# Altium schematic sheet RMT_SCH.SchDoc
size A4
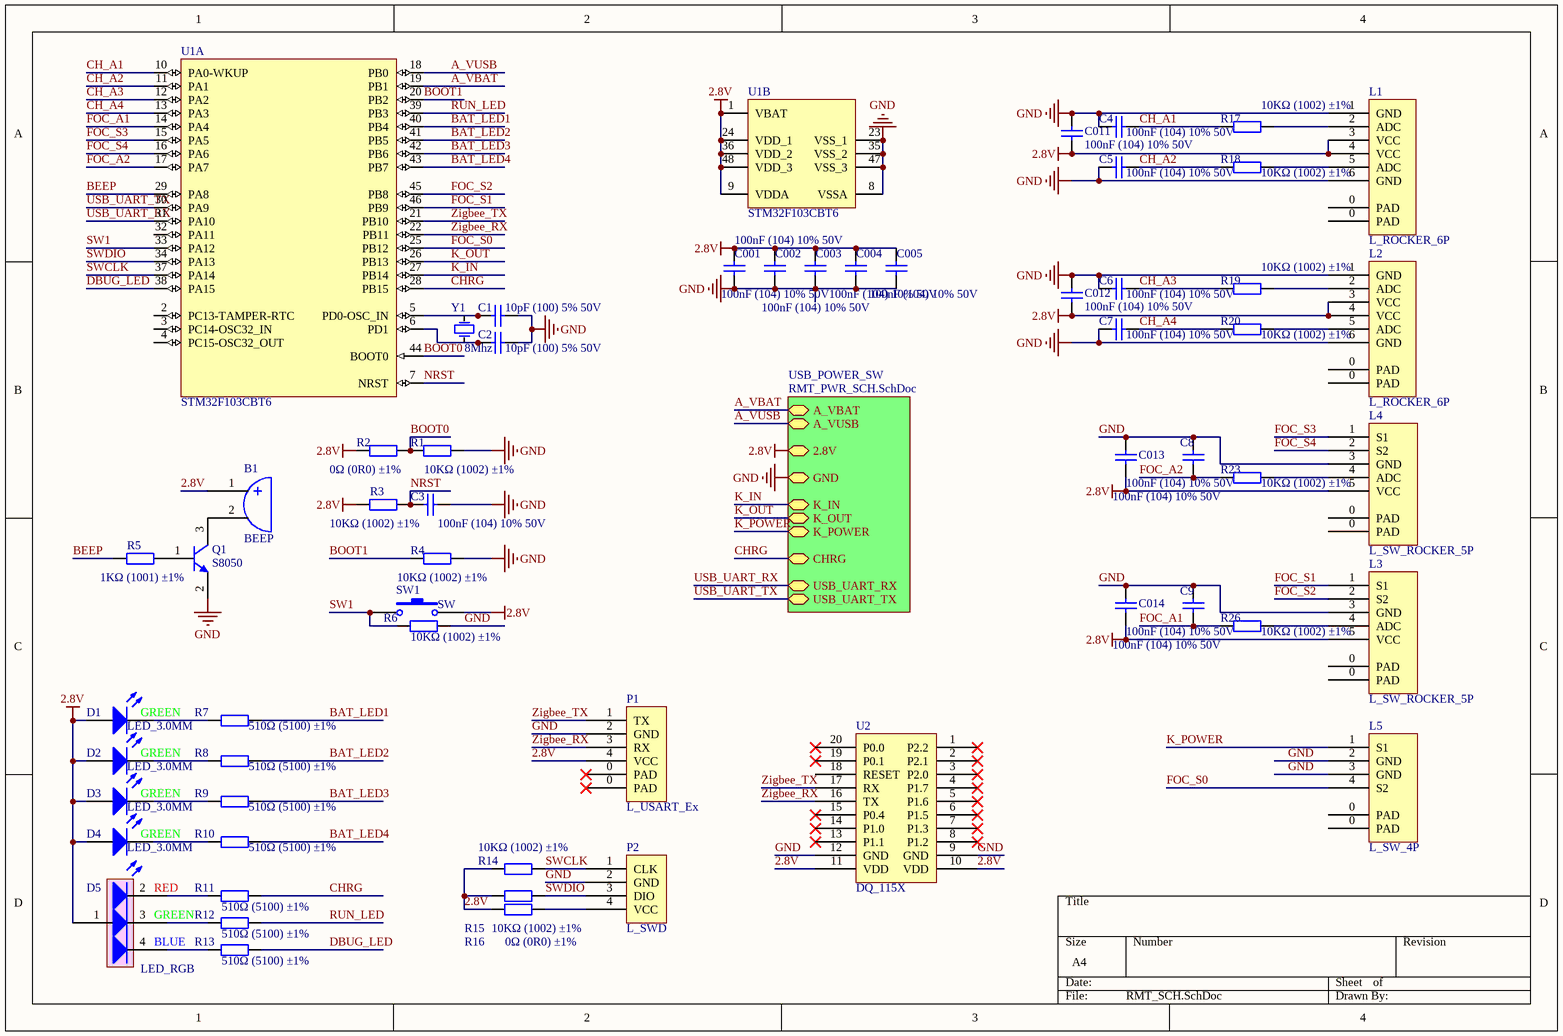
[diagram p0: RMT_SCH.SchDoc]

## Parts
B1  BEEP  [BEEP_0905]
C1  10pF (100) 5% 50V  [0603_C]
C001  100nF (104) 10% 50V  [0603_C]
C2  10pF (100) 5% 50V  [0603_C]
C002  100nF (104) 10% 50V  [0603_C]
C3  100nF (104) 10% 50V  [0603_C]
C003  100nF (104) 10% 50V  [0603_C]
C4  100nF (104) 10% 50V  [0603_C]
C004  100nF (104) 10% 50V  [0603_C]
C5  100nF (104) 10% 50V  [0603_C]
C005  100nF (104) 10% 50V  [0603_C]
C6  100nF (104) 10% 50V  [0603_C]
C7  100nF (104) 10% 50V  [0603_C]
C8  100nF (104) 10% 50V  [0603_C]
C9  100nF (104) 10% 50V  [0603_C]
C011  100nF (104) 10% 50V  [0603_C]
C012  100nF (104) 10% 50V  [0603_C]
C013  100nF (104) 10% 50V  [0603_C]
C014  100nF (104) 10% 50V  [0603_C]
D1  LED_3.0MM  [LED_A2]
D2  LED_3.0MM  [LED_A2]
D3  LED_3.0MM  [LED_A2]
D4  LED_3.0MM  [LED_A2]
D5  LED_RGB  [LED_3DIP]
L1  L_ROCKER_6P  [DF13-6P]
L2  L_ROCKER_6P  [DF13-6P]
L3  L_SW_ROCKER_5P  [DF13-5P]
L4  L_SW_ROCKER_5P  [DF13-5P]
L5  L_SW_4P  [DF13-4P]
P1  L_USART_Ex  [BM04B-GHS-TBT]
P2  L_SWD  [MOLEX-53398-0471]
Q1  S8050  [SOP23-3]
R1  10KΩ (1002) ±1%  [0603_R]
R2  0Ω (0R0) ±1%  [0603_R]
R3  10KΩ (1002) ±1%  [0603_R]
R4  10KΩ (1002) ±1%  [0603_R]
R5  1KΩ (1001) ±1%  [0603_R]
R6  10KΩ (1002) ±1%  [0603_R]
R7  510Ω (5100) ±1%  [0603_R]
R8  510Ω (5100) ±1%  [0603_R]
R9  510Ω (5100) ±1%  [0603_R]
R10  510Ω (5100) ±1%  [0603_R]
R11  510Ω (5100) ±1%  [0603_R]
R12  510Ω (5100) ±1%  [0603_R]
R13  510Ω (5100) ±1%  [0603_R]
R14  10KΩ (1002) ±1%  [0603_R]
R15  10KΩ (1002) ±1%  [0603_R]
R16  0Ω (0R0) ±1%  [0603_R]
R17  10KΩ (1002) ±1%  [0603_R]
R18  10KΩ (1002) ±1%  [0603_R]
R19  10KΩ (1002) ±1%  [0603_R]
R20  10KΩ (1002) ±1%  [0603_R]
R23  10KΩ (1002) ±1%  [0603_R]
R26  10KΩ (1002) ±1%  [0603_R]
SW1  SW  [SW-PB2-A1]
U1  STM32F103CBT6  [LQFP-48_7x7x05P]  (parts A,B of 2)
U2  DQ_115X  [LW_1151]
Y1  value 8Mhz  [5032]  (hidden comment: XTAL)

## Sub-sheets
USB_POWER_SW = RMT_PWR_SCH.SchDoc: A_VBAT, A_VUSB, 2.8V, CHRG, GND, K_IN, K_OUT, K_POWER, USB_UART_RX, USB_UART_TX

## Nets
2.8V: B1.1 C001.2 C002.2 C003.2 C004.2 C005.2 C011.2 C012.2 C013.1 C014.1 D1.1(A) D2.1(A) D3.1(A) D4.1(A) D5.1(A) L1.3(VCC) L1.4(VCC) L2.3(VCC) L2.4(VCC) L3.5(VCC) L4.5(VCC) P1.4(VCC) R2.1 R3.1 R14.1 R15.1 R16.1 SW1.2 U1.1(VBAT) U1.9(VDDA) U1.24(VDD_1) U1.36(VDD_2) U1.48(VDD_3) U2.10(VDD) U2.11(VDD) ; sheet USB_POWER_SW/2.8V
GND: C1.1 C001.1 C2.1 C002.1 C003.1 C3.2 C004.1 C4.2 C005.1 C5.2 C6.2 C7.2 C8.2 C9.2 C011.1 C012.1 C013.2 C014.2 L1.1(GND) L1.6(GND) L2.1(GND) L2.6(GND) L3.3(GND) L4.3(GND) L5.2(GND) L5.3(GND) P1.2(GND) P2.2(GND) Q1.2(E) R1.2 R4.2 R6.1 U1.8(VSSA) U1.23(VSS_1) U1.35(VSS_2) U1.47(VSS_3) U2.9(GND) U2.12(GND) ; sheet USB_POWER_SW/GND
A_VBAT: U1.19(PB1) ; sheet USB_POWER_SW/A_VBAT
A_VUSB: U1.18(PB0) ; sheet USB_POWER_SW/A_VUSB
BAT_LED1: R7.2 U1.40(PB4)
BAT_LED2: R8.2 U1.41(PB5)
BAT_LED3: R9.2 U1.42(PB6)
BAT_LED4: R10.2 U1.43(PB7)
BEEP: R5.1 U1.29(PA8)
BOOT0: R1.1 R2.2 U1.44(BOOT0)
BOOT1: R4.1 U1.20(PB2)
CH_A1: C4.1 R17.2 U1.10(PA0-WKUP)
CH_A2: C5.1 R18.2 U1.11(PA1)
CH_A3: C6.1 R19.2 U1.12(PA2)
CH_A4: C7.1 R20.2 U1.13(PA3)
CHRG: R11.2 U1.28(PB15) ; sheet USB_POWER_SW/CHRG
DBUG_LED: R13.2 U1.38(PA15)
FOC_A1: C9.1 R26.2 U1.14(PA4)
FOC_A2: C8.1 R23.2 U1.17(PA7)
FOC_S0: L5.4(S2) U1.25(PB12)
FOC_S1: L3.1(S1) U1.46(PB9)
FOC_S2: L3.2(S2) U1.45(PB8)
FOC_S3: L4.1(S1) U1.15(PA5)
FOC_S4: L4.2(S2) U1.16(PA6)
K_IN: U1.27(PB14) ; sheet USB_POWER_SW/K_IN
K_OUT: U1.26(PB13) ; sheet USB_POWER_SW/K_OUT
K_POWER: L5.1(S1) ; sheet USB_POWER_SW/K_POWER
NRST: C3.1 R3.2 U1.7(NRST)
RUN_LED: R12.2 U1.39(PB3)
SW1: R6.2 SW1.1 U1.33(PA12)
SWCLK: P2.1(CLK) R14.2 U1.37(PA14)
SWDIO: P2.3(DIO) R15.2 U1.34(PA13)
USB_UART_RX: U1.31(PA10) ; sheet USB_POWER_SW/USB_UART_RX
USB_UART_TX: U1.30(PA9) ; sheet USB_POWER_SW/USB_UART_TX
Zigbee_RX: P1.3(RX) U1.22(PB11) U2.16(TX)
Zigbee_TX: P1.1(TX) U1.21(PB10) U2.17(RX)
NetB1_2: B1.2 Q1.3(C)
NetC1_2: C1.2 U1.5(PD0-OSC_IN) Y1.2(OSC2)
NetC2_2: C2.2 U1.6(PD1) Y1.1(OSC1)
NetD1_2: D1.2(K) R7.1
NetD2_2: D2.2(K) R8.1
NetD3_2: D3.2(K) R9.1
NetD4_2: D4.2(K) R10.1
NetD5_2: D5.2(R) R11.1
NetD5_3: D5.3(G) R12.1
NetD5_4: D5.4(B) R13.1
NetL1_2: L1.2(ADC) R17.1
NetL1_5: L1.5(ADC) R18.1
NetL2_2: L2.2(ADC) R19.1
NetL2_5: L2.5(ADC) R20.1
NetL3_4: L3.4(ADC) R26.1
NetL4_4: L4.4(ADC) R23.1
NetP2_4: P2.4(VCC) R16.2
NetQ1_1: Q1.1(B) R5.2

Not connected (* = marked no-connect by the designer): L1 0(PAD); L2 0(PAD); L3 0(PAD); L4 0(PAD); L5 0(PAD); P1 0(PAD)*; U1 2(PC13-TAMPER-RTC) 3(PC14-OSC32_IN) 4(PC15-OSC32_OUT) 32(PA11); U2 1(P2.2)* 2(P2.1)* 3(P2.0)* 4(P1.7)* 5(P1.6)* 6(P1.5)* 7(P1.3)* 8(P1.2)* 13(P1.1)* 14(P1.0)* 15(P0.4)* 18(RESET) 19(P0.1)* 20(P0.0)*

## Notes on the sheet
- (near D1) GREEN
- (near D2) GREEN
- (near D3) GREEN
- (near D4) GREEN
- (near D5) RED
- GREEN
- BLUE

## Library data of the parts
B1 = BEEP: 有源蜂鸣器
C1 C2 = 0603 10pF (100) 5% 50V: 贴片电容; ComponentLink1Description: 供应商链接; ComponentLink1URL: http://www.szlcsc.com/product/details_1986.html; Package: 0603; Supplier: LC; SuppliersPartNumber: C1634
C001 C002 C3 C003 C4 C004 C5 C005-C9 C011 C012 C013 C014 = 0603 100nF (104) 10% 50V: 贴片电容; ComponentLink1Description: 供应商链接; ComponentLink1URL: http://www.szlcsc.com/product/details_15331.html; Package: 0603; Supplier: LC; SuppliersPartNumber: C14663
D1-D4 = LED_3.0MM: 3MM LED
D5 = LED_RGB: 三色led
L1 L2 = L_ROCKER_6P: 摇杆连接器; pin to pad: 1>6 2>5 3>4 4>3 5>2 6>1
L3 L4 = L_SW_ROCKER_5P: 开关摇杆模块; pin to pad: 1>5 2>4 4>2 5>1
L5 = L_SW_4P: 开关模块
P1 = L_USART_Ex: 串口扩展
P2 = L_SWD: SWD调试
Q1 = S8050: 三极管
R1 R3 R4 R6 R14 R15 R17-R20 R23 R26 = 0603 10KΩ (1002) 1%: 贴片电阻; ComponentLink1Description: 供应商链接; ComponentLink1URL: http://www.szlcsc.com/product/details_26547.html; Package: 0603; Supplier: LC; SuppliersPartNumber: C25804
R2 R16 = 0603 0Ω (0R0) 1%: 贴片电阻; ComponentLink1Description: 供应商链接; ComponentLink1URL: http://www.szlcsc.com/product/details_21903.html; Package: 0603; Supplier: LC; SuppliersPartNumber: C21189
R5 = 0603 1KΩ (1001) 1%: 贴片电阻; ComponentLink1Description: 供应商链接; ComponentLink1URL: http://www.szlcsc.com/product/details_21904.html; Package: 0603; Supplier: LC; SuppliersPartNumber: C21190
R7-R13 = 0603 510Ω (5100) 1%: 贴片电阻; ComponentLink1Description: 供应商链接; ComponentLink1URL: http://www.szlcsc.com/product/details_23920.html; Package: 0603; Supplier: LC; SuppliersPartNumber: C23193
SW1 = SW: 微动开关
U1 = STM32F103CBT6: ARM; ComponentLink1Description: 供应商链接; ComponentLink1URL: http://www.szlcsc.com/product/details_8796.html; Package: LQFP-48_7x7x05P; Supplier: LC; SuppliersPartNumber: C8304
U2 = DQ_115X: zigbee_usart
Y1 = XTAL: 无源晶振